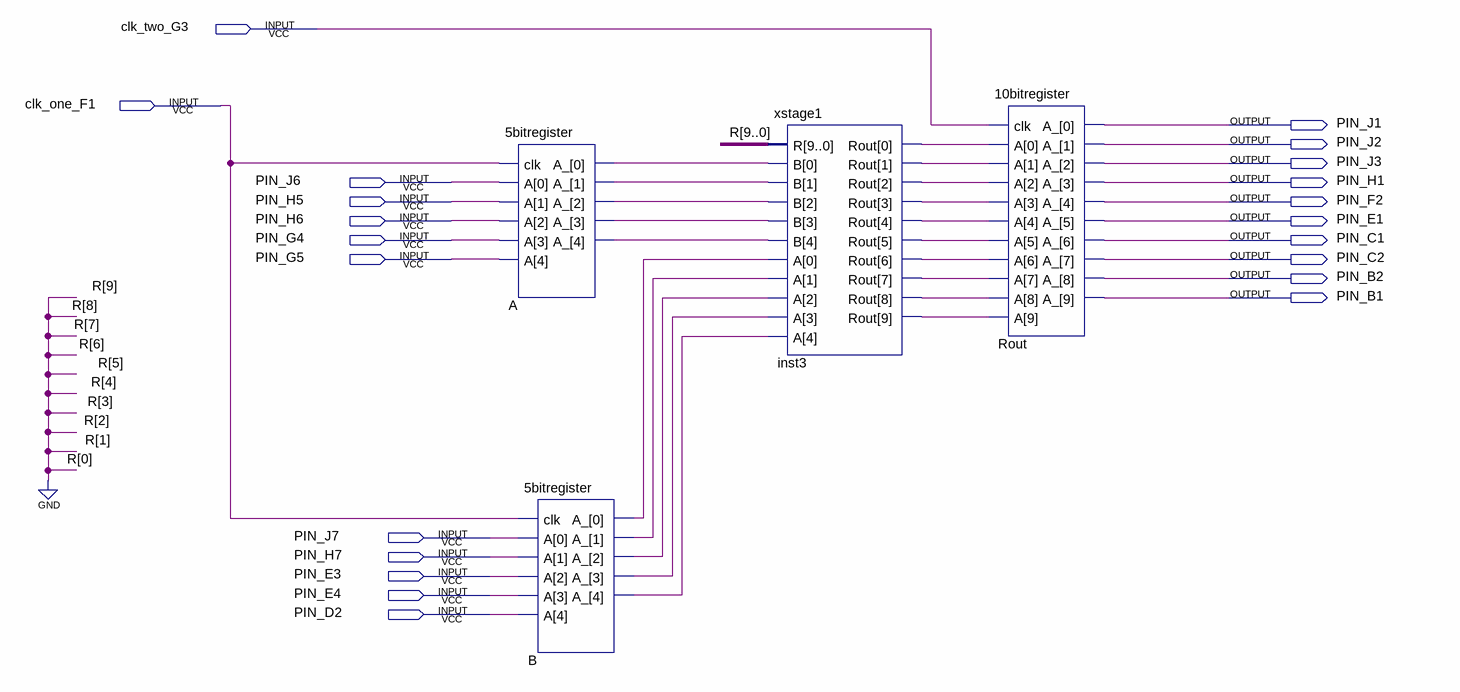
[diagram p0: schematic sheet]
// Quartus schematic mult_reg.bdf as structural Verilog: 4 symbols, 22 pins
module mult_reg (
  input  clk_two_G3,
  input  clk_one_F1,
  input  PIN_J6,
  input  PIN_H5,
  input  PIN_H6,
  input  PIN_G4,
  input  PIN_G5,
  input  PIN_J7,
  input  PIN_H7,
  input  PIN_E3,
  input  PIN_E4,
  input  PIN_D2,
  output PIN_J1,
  output PIN_J2,
  output PIN_J3,
  output PIN_H1,
  output PIN_F2,
  output PIN_E1,
  output PIN_C1,
  output PIN_C2,
  output PIN_B2,
  output PIN_B1
);

  wire A_a_, A_a__2, A_a__3, A_a__4, A_a__5, B_a_, B_a__2, B_a__3, B_a__4, B_a__5, inst3_rout, inst3_rout_2,
       inst3_rout_3, inst3_rout_4, inst3_rout_5, inst3_rout_6, inst3_rout_7, inst3_rout_8, inst3_rout_9,
       inst3_rout_10;

  \5bitregister  A (
    .clk(clk_one_F1), .A({PIN_G5, PIN_G4, PIN_H6, PIN_H5, PIN_J6}),
    .A_({A_a__5, A_a__4, A_a__3, A_a__2, A_a_}));
  \5bitregister  B (
    .clk(clk_one_F1), .A({PIN_D2, PIN_E4, PIN_E3, PIN_H7, PIN_J7}),
    .A_({B_a__5, B_a__4, B_a__3, B_a__2, B_a_}));
  xstage1 inst3 (
    .R({10{1'b0}}), .B({A_a__5, A_a__4, A_a__3, A_a__2, A_a_}), .A({B_a__5, B_a__4, B_a__3, B_a__2, B_a_}),
    .Rout({inst3_rout_10, inst3_rout_9, inst3_rout_8, inst3_rout_7, inst3_rout_6, inst3_rout_5, inst3_rout_4, inst3_rout_3, inst3_rout_2, inst3_rout}));
  \10bitregister  Rout (
    .clk(clk_two_G3),
    .A({inst3_rout_10, inst3_rout_9, inst3_rout_8, inst3_rout_7, inst3_rout_6, inst3_rout_5, inst3_rout_4, inst3_rout_3, inst3_rout_2, inst3_rout}),
    .A_({PIN_B1, PIN_B2, PIN_C2, PIN_C1, PIN_E1, PIN_F2, PIN_H1, PIN_J3, PIN_J2, PIN_J1}));
endmodule
